# Altium schematic sheet Main_board.SchDoc
size A4; SheetNumber: 1; SheetTotal: 7
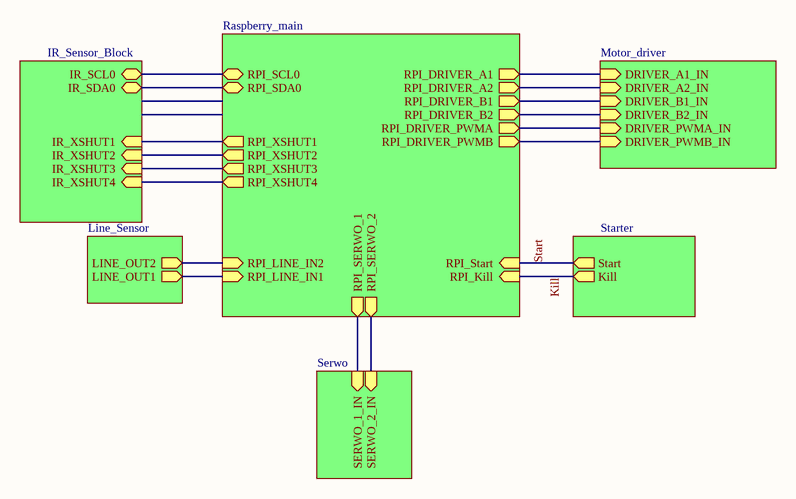
[diagram p0: Main_board.SchDoc]

## Sub-sheets
U_IR_Sensor_Block = IR_Sensor_Block: IR_SCL0 (bidir), IR_SDA0 (bidir), IR_XSHUT1 (in), IR_XSHUT2 (in), IR_XSHUT3 (in), IR_XSHUT4 (in)
U_Line_Sensor = Line_Sensor: LINE_OUT1 (out), LINE_OUT2 (out)
U_motor_driver = Motor_driver: DRIVER_A1_IN (in), DRIVER_A2_IN (in), DRIVER_B1_IN (in), DRIVER_B2_IN (in), DRIVER_PWMA_IN (in), DRIVER_PWMB_IN (in)
U_Raspberry_main = Raspberry_main: RPI_LINE_IN1 (in), RPI_LINE_IN2 (in), RPI_SERWO_1 (out), RPI_SERWO_2 (out), RPI_XSHUT1 (out), RPI_XSHUT2 (out), RPI_XSHUT3 (out), RPI_XSHUT4 (out), RPI_DRIVER_A1 (out), RPI_DRIVER_A2 (out), RPI_DRIVER_B1 (out), RPI_DRIVER_B2 (out), RPI_DRIVER_PWMA (out), RPI_DRIVER_PWMB (out), RPI_Start (in), RPI_Kill (in), RPI_SCL0 (bidir), RPI_SDA0 (bidir)
U_Serwo = Serwo: SERWO_2_IN (in), SERWO_1_IN (in)
U_Starter = Starter: Start (out), Kill (out)

## Nets
Kill: sheet U_Raspberry_main/RPI_Kill, sheet U_Starter/Kill
Start: sheet U_Raspberry_main/RPI_Start, sheet U_Starter/Start
(unnamed): sheet U_Raspberry_main/RPI_LINE_IN1, sheet U_Line_Sensor/LINE_OUT1
(unnamed): sheet U_Raspberry_main/RPI_LINE_IN2, sheet U_Line_Sensor/LINE_OUT2
(unnamed): sheet U_Raspberry_main/RPI_SERWO_1, sheet U_Serwo/SERWO_1_IN
(unnamed): sheet U_Raspberry_main/RPI_SERWO_2, sheet U_Serwo/SERWO_2_IN
(unnamed): sheet U_Raspberry_main/RPI_XSHUT1, sheet U_IR_Sensor_Block/IR_XSHUT1
(unnamed): sheet U_Raspberry_main/RPI_XSHUT2, sheet U_IR_Sensor_Block/IR_XSHUT2
(unnamed): sheet U_Raspberry_main/RPI_XSHUT3, sheet U_IR_Sensor_Block/IR_XSHUT3
(unnamed): sheet U_Raspberry_main/RPI_XSHUT4, sheet U_IR_Sensor_Block/IR_XSHUT4
(unnamed): sheet U_Raspberry_main/RPI_DRIVER_A1, sheet U_motor_driver/DRIVER_A1_IN
(unnamed): sheet U_Raspberry_main/RPI_DRIVER_A2, sheet U_motor_driver/DRIVER_A2_IN
(unnamed): sheet U_Raspberry_main/RPI_DRIVER_B1, sheet U_motor_driver/DRIVER_B1_IN
(unnamed): sheet U_Raspberry_main/RPI_DRIVER_B2, sheet U_motor_driver/DRIVER_B2_IN
(unnamed): sheet U_Raspberry_main/RPI_DRIVER_PWMA, sheet U_motor_driver/DRIVER_PWMA_IN
(unnamed): sheet U_Raspberry_main/RPI_DRIVER_PWMB, sheet U_motor_driver/DRIVER_PWMB_IN
(unnamed): sheet U_Raspberry_main/RPI_SCL0, sheet U_IR_Sensor_Block/IR_SCL0
(unnamed): sheet U_Raspberry_main/RPI_SDA0, sheet U_IR_Sensor_Block/IR_SDA0